# Altium project Industrial-IO.PrjPcb
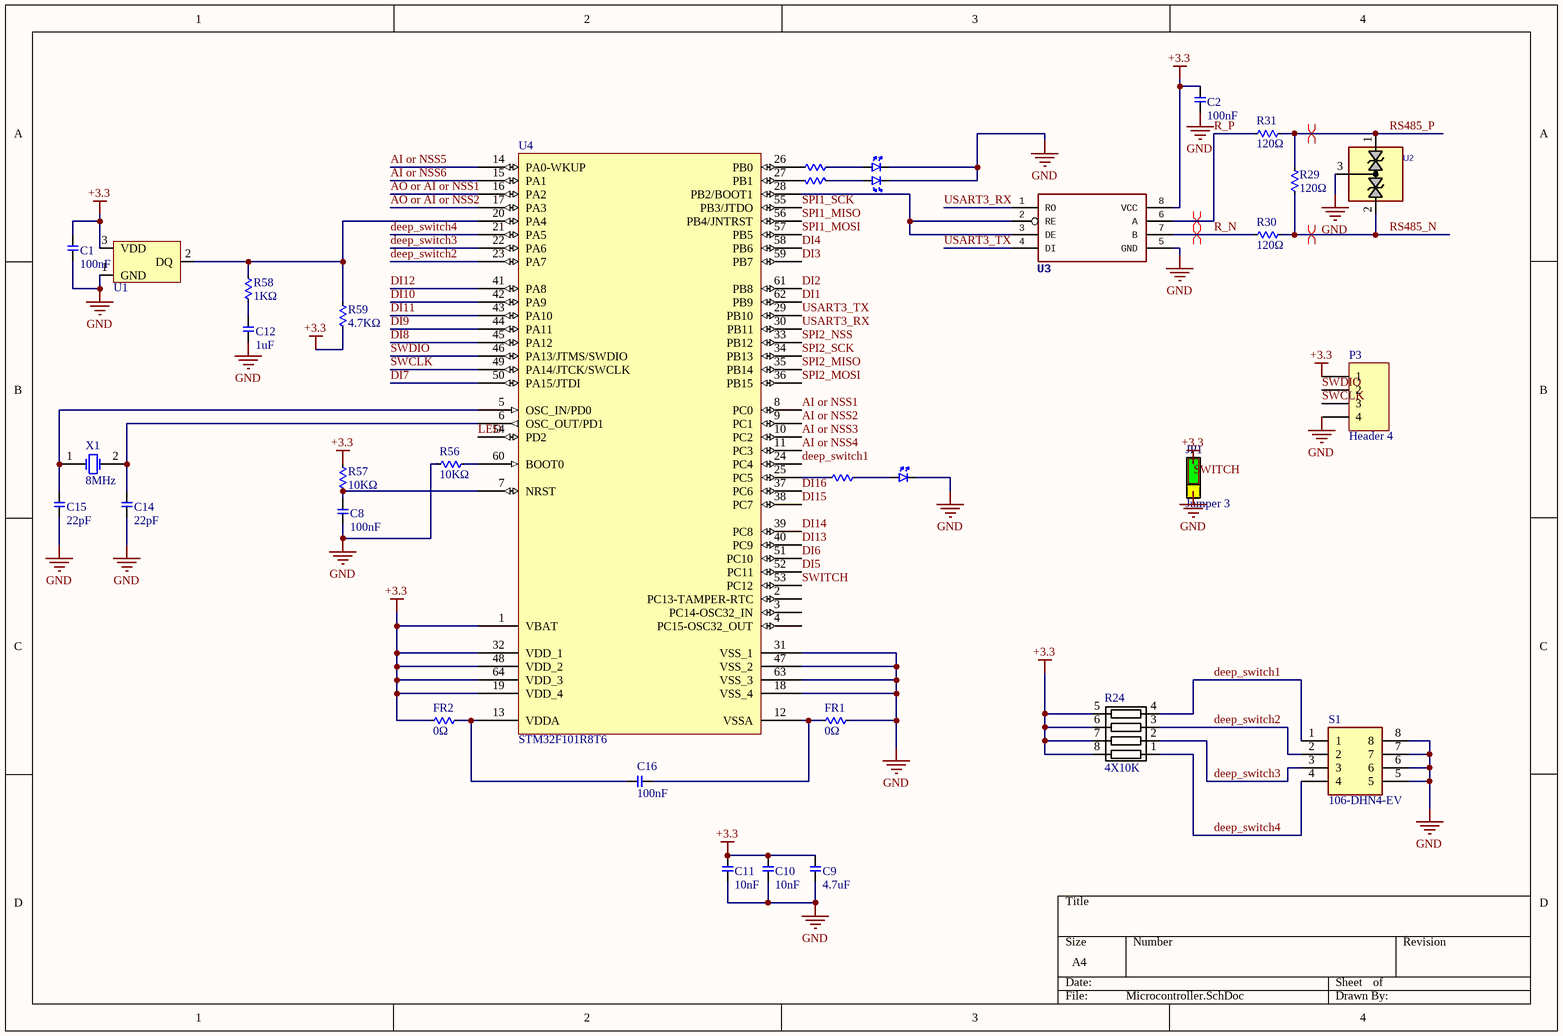
[diagram p0: Microcontroller.SchDoc]
5 sheets, 229 parts. Net scope: global (net labels, ports and power ports of the same name join across sheets).
Board file: Industrial-IO.PcbDoc
Sheets:
  Microcontroller.SchDoc
  Digital Input.SchDoc
  Digital Output.SchDoc
  Connector.SchDoc
  Indicator.SchDoc

## Sheet Microcontroller.SchDoc
size A4

### Parts
(Parts that share a designator on the sheet are numbered #1, #2 ... from top to bottom, then left to right.)
C1  100nF  [CAP 0603 100n]
C2  100nF  [CAP_0603]
C8  100nF  [CAP_0603]
C9  4.7uF  [CAP 0603 4.7u]
C10  10nF  [CAP 0603 10n]
C11  10nF  [CAP 0603 10n]
C12  1uF  [CAP 0603 1u]
C14  22pF  [CAP 0603 22p]
C15  22pF  [CAP 0603 22p]
C16  100nF  [CAP 0603 100n]
D1  LED  [LED 0603 RED]  (value not drawn)
D18  LED  [LED 0603 GREEN]  (value not drawn)
D19  LED  [LED 0603 GREEN]  (value not drawn)
FR1  0Ω  [RES 0603 0]
FR2  0Ω  [RES 0603 0]
JP1  Jumper 3  [Jumper 3 Blue]
P3#1  Header 4  [CON_MALE_4_2.54MM]
R17  100Ω  [RES 0603 100]  (value not drawn)
R18  100Ω  [RES 0603 100]  (value not drawn)
R19  100Ω  [RES 0603 100]  (value not drawn)
R24  4X10K  [RES ARRAY 4X0603 1.2K]
R29  120Ω  [RES 0603 120]
R30  120Ω  [RES 0603 120]
R31  120Ω  [RES 0603 120]
R56  10KΩ  [RES 0603 10K]
R57  10KΩ  [RES 0603 10K]
R58  1KΩ  [RES 0603]
R59  4.7KΩ  [RES 0603 4.7K]
S1  106-DHN4-EV  [dip_switch4]
U1  DS18B20  [SEMI_TO92W]  (value not drawn)
U2  CDSOT23-SM712  [SOT23_3]  (value not drawn)
U3  ADM485  [SEMI_SO8]  (value not drawn)
U4  STM32F101R8T6  [LQFP64_N]
X1  value 8MHz  [XTAL_HC49S]  (hidden comment: Xtal)

### Nets
+3.3: C1.1 C2.1 C9.1 C10.1 C11.1 FR2.1 JP1.1 P3#1.1 R24.5 R24.6 R24.7 R24.8 R57.1 R59.2 U1.3(VDD) U3.8(VCC) U4.1(VBAT) U4.19(VDD_4) U4.32(VDD_1) U4.48(VDD_2) U4.64(VDD_3)
GND: C1.2 C2.2 C8.2 C9.2 C10.2 C11.2 C12.2 C14.2 C15.2 D1.2 D18.2 D19.2 FR1.2 JP1.3 P3#1.4 R56.1 S1.5 S1.6 S1.7 S1.8 U1.1(GND) U2.3(NC) U3.5(GND) U4.18(VSS_4) U4.31(VSS_1) U4.47(VSS_2) U4.63(VSS_3)
AI or NSS1: U4.8(PC0)
AI or NSS2: U4.9(PC1)
AI or NSS3: U4.10(PC2)
AI or NSS4: U4.11(PC3)
AI or NSS5: U4.14(PA0-WKUP)
AI or NSS6: U4.15(PA1)
AO or AI or NSS1: U4.16(PA2)
AO or AI or NSS2: U4.17(PA3)
deep_switch1: R24.4 S1.1 U4.24(PC4)
deep_switch2: R24.3 S1.2 U4.23(PA7)
deep_switch3: R24.2 S1.3 U4.22(PA6)
deep_switch4: R24.1 S1.4 U4.21(PA5)
DI1: U4.62(PB9)
DI2: U4.61(PB8)
DI3: U4.59(PB7)
DI4: U4.58(PB6)
DI5: U4.52(PC11)
DI6: U4.51(PC10)
DI7: U4.50(PA15/JTDI)
DI8: U4.45(PA12)
DI9: U4.44(PA11)
DI10: U4.42(PA9)
DI11: U4.43(PA10)
DI12: U4.41(PA8)
DI13: U4.40(PC9)
DI14: U4.39(PC8)
DI15: U4.38(PC7)
DI16: U4.37(PC6)
LED: U4.54(PD2)
R_N: R30.1 U3.7(B)
R_P: R31.1 U3.6(A)
RS485_N: R29.2 R30.2 U2.2(GND)
RS485_P: R29.1 R31.2 U2.1(NC)
SPI1_MISO: U4.56(PB4/JNTRST)
SPI1_MOSI: U4.57(PB5)
SPI1_SCK: U4.55(PB3/JTDO)
SPI2_MISO: U4.35(PB14)
SPI2_MOSI: U4.36(PB15)
SPI2_NSS: U4.33(PB12)
SPI2_SCK: U4.34(PB13)
SWCLK: P3#1.3 U4.49(PA14/JTCK/SWCLK)
SWDIO: P3#1.2 U4.46(PA13/JTMS/SWDIO)
SWITCH: JP1.2 U4.53(PC12)
USART3_RX: U3.1(RO) U4.30(PB11)
USART3_TX: U3.4(DI) U4.29(PB10)
NetC8_1: C8.1 R57.2 U4.7(NRST)
NetC12_1: C12.1 R58.2
NetC14_1: C14.1 U4.6(OSC_OUT/PD1) X1.2(OSC2)
NetC15_1: C15.1 U4.5(OSC_IN/PD0) X1.1(OSC1)
NetC16_1: C16.1 FR2.2 U4.13(VDDA)
NetC16_2: C16.2 FR1.1 U4.12(VSSA)
NetD1_1: D1.1 R17.1
NetD18_1: D18.1 R18.1
NetD19_1: D19.1 R19.1
NetR17_2: R17.2 U4.27(PB1)
NetR18_2: R18.2 U4.26(PB0)
NetR19_2: R19.2 U4.25(PC5)
NetR56_2: R56.2 U4.60(BOOT0)
NetR58_1: R58.1 R59.1 U1.2(DQ) U4.20(PA4)
NetU3_2: U3.2(RE) U3.3(DE) U4.28(PB2/BOOT1)

Not connected (* = marked no-connect by the designer): U4 2(PC13-TAMPER-RTC) 3(PC14-OSC32_IN) 4(PC15-OSC32_OUT)

### Layout directives
differential pair: R_N, R_P, RS485_N, RS485_P

### Library data of the parts
C1 C2 C8 C16 = CAP 100nF
C9 = CAP 4.7uF
C10 C11 = CAP 10nF
C12 = CAP 1UF
C14 C15 = CAP 22pF
FR1 FR2 = RES 0
P3#1 = Header 4: Header, 4-Pin; LatestRevisionDate: 17-Jul-2002; LatestRevisionNote: Re-released for DXP Platform.; Publisher: Altium Limited
R17-R19 = RES 100
R24 = ARRAY4-10K-BOURNS: GENERIC RESISTOR ARRAY 4X INDEPENDENT; Reel: RA4
R29-R31 = RES 120
R56 R57 = RES 10K
R58 = RES
R59 = RES 4.7K
S1 = 106-DHN4-EV: Switch; Manufacturer_Name: Mountain Switch; Datasheet Link: https://componentsearchengine.com/Datasheets/1/106-DHN4-EV.pdf; Height: 1.55mm; Manufacturer_Part_Number: 106-DHN4-EV; Arrow Part Number: 106-DHN4-EV; Mouser Part Number: 106-DHN4-EV; Mouser Price/Stock: https://www.mouser.com/Search/Refine.aspx?Keyword=106-DHN4-EV
U2 = TVS_X2_CDSOT23-SM712: TVS, ESD PROTECT, 2CH, 400W/17A PP, 7.5VBR, ±8KV ESDmin; MANF: Bourns; PARAM: 400W/17A peak-pulse; MANF_P#: CDSOT23-SM712; PARAM2: 7.5VBR, ±8KV ESD min; PRICE: 1.6$; VALUE: CDSOT23-SM712
U4 = STM32F101R8T6: STM32 ARM-based 32-bit MCU with 64 Kbytes Flash, 64-pin LQFP, Industrial Temperature; Published: 30-May-2008; DatasheetVersion: rev6, Mar-2008; PackageVersion: Mar-2008; PackageReference: LQFP64; Publisher: Altium Limited; PackageDescription: 64-Pin Low-Profile Quad Flat Pack, 10 x 10 mm Body, 0.5 mm Pitch (LQFP64); ComponentLink1Description: Manufacturer Link; ComponentLink1URL: www.st.com/stm32; ComponentLink2Description: Datasheet; ComponentLink2URL: http://www.st.com/stonline/products/literature/ds/13586.pdf

## Sheet Digital Input.SchDoc
size A4
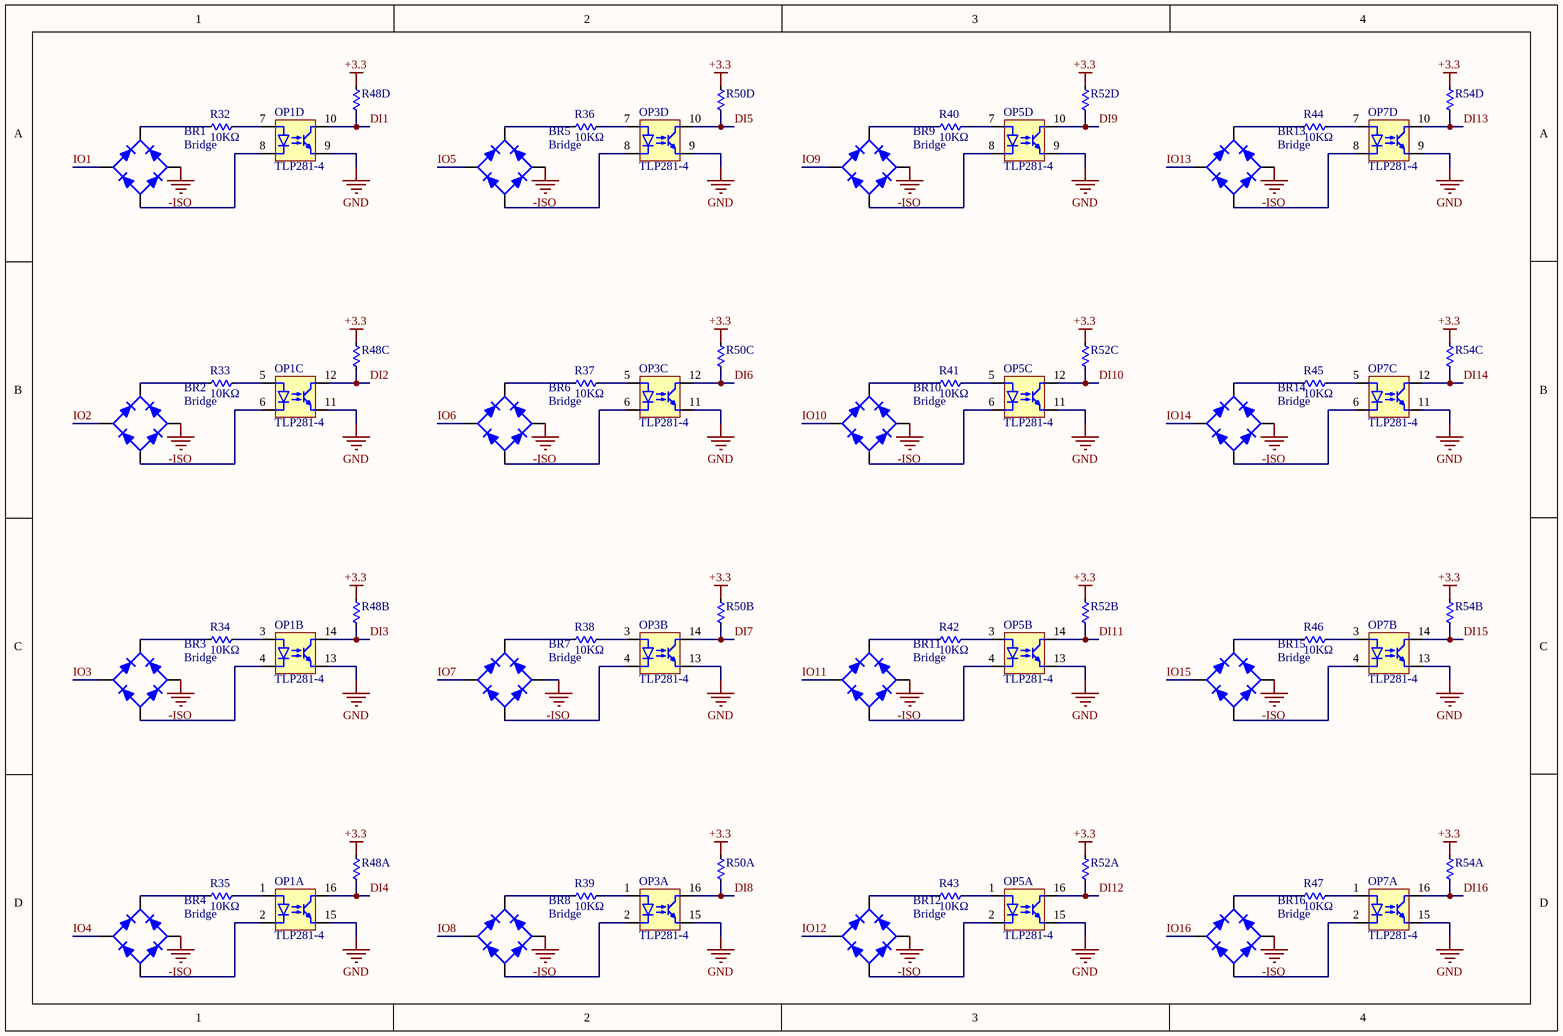
[diagram p1: Digital Input.SchDoc]

### Parts
BR1  Bridge  [SOP254P690X270-4L]
BR2  Bridge  [SOP254P690X270-4L]
BR3  Bridge  [SOP254P690X270-4L]
BR4  Bridge  [SOP254P690X270-4L]
BR5  Bridge  [SOP254P690X270-4L]
BR6  Bridge  [SOP254P690X270-4L]
BR7  Bridge  [SOP254P690X270-4L]
BR8  Bridge  [SOP254P690X270-4L]
BR9  Bridge  [SOP254P690X270-4L]
BR10  Bridge  [SOP254P690X270-4L]
BR11  Bridge  [SOP254P690X270-4L]
BR12  Bridge  [SOP254P690X270-4L]
BR13  Bridge  [SOP254P690X270-4L]
BR14  Bridge  [SOP254P690X270-4L]
BR15  Bridge  [SOP254P690X270-4L]
BR16  Bridge  [SOP254P690X270-4L]
OP1  TLP281-4  [SO16 TOSHIBA OPTOCOUPLER]  (parts A,B,C,D of 4)
OP3  TLP281-4  [SO16 TOSHIBA OPTOCOUPLER]  (parts A,B,C,D of 4)
OP5  TLP281-4  [SO16 TOSHIBA OPTOCOUPLER]  (parts A,B,C,D of 4)
OP7  TLP281-4  [SO16 TOSHIBA OPTOCOUPLER]  (parts A,B,C,D of 4)
R32  10KΩ  [RES 0603 10K]
R33  10KΩ  [RES 0603 10K]
R34  10KΩ  [RES 0603 10K]
R35  10KΩ  [RES 0603 10K]
R36  10KΩ  [RES 0603 10K]
R37  10KΩ  [RES 0603 10K]
R38  10KΩ  [RES 0603 10K]
R39  10KΩ  [RES 0603 10K]
R40  10KΩ  [RES 0603 10K]
R41  10KΩ  [RES 0603 10K]
R42  10KΩ  [RES 0603 10K]
R43  10KΩ  [RES 0603 10K]
R44  10KΩ  [RES 0603 10K]
R45  10KΩ  [RES 0603 10K]
R46  10KΩ  [RES 0603 10K]
R47  10KΩ  [RES 0603 10K]
R48  10KΩ  [RES ARRAY 4X0603 10K]  (value not drawn)  (parts A,B,C,D of 4)
R50  10KΩ  [RES ARRAY 4X0603 10K]  (value not drawn)  (parts A,B,C,D of 4)
R52  10KΩ  [RES ARRAY 4X0603 10K]  (value not drawn)  (parts A,B,C,D of 4)
R54  10KΩ  [RES ARRAY 4X0603 10K]  (value not drawn)  (parts A,B,C,D of 4)

### Nets
+3.3: R48.5 R48.6 R48.7 R48.8 R50.5 R50.6 R50.7 R50.8 R52.5 R52.6 R52.7 R52.8 R54.5 R54.6 R54.7 R54.8
-ISO: BR1.4 BR2.4 BR3.4 BR4.4 BR5.4 BR6.4 BR7.4 BR8.4 BR9.4 BR10.4 BR11.4 BR12.4 BR13.4 BR14.4 BR15.4 BR16.4
GND: OP1.9 OP1.11 OP1.13 OP1.15 OP3.9 OP3.11 OP3.13 OP3.15 OP5.9 OP5.11 OP5.13 OP5.15 OP7.9 OP7.11 OP7.13 OP7.15
DI1: OP1.10 R48.4
DI2: OP1.12 R48.3
DI3: OP1.14 R48.2
DI4: OP1.16 R48.1
DI5: OP3.10 R50.4
DI6: OP3.12 R50.3
DI7: OP3.14 R50.2
DI8: OP3.16 R50.1
DI9: OP5.10 R52.4
DI10: OP5.12 R52.3
DI11: OP5.14 R52.2
DI12: OP5.16 R52.1
DI13: OP7.10 R54.4
DI14: OP7.12 R54.3
DI15: OP7.14 R54.2
DI16: OP7.16 R54.1
IO1: BR1.3
IO2: BR2.3
IO3: BR3.3
IO4: BR4.3
IO5: BR5.3
IO6: BR6.3
IO7: BR7.3
IO8: BR8.3
IO9: BR9.3
IO10: BR10.3
IO11: BR11.3
IO12: BR12.3
IO13: BR13.3
IO14: BR14.3
IO15: BR15.3
IO16: BR16.3
NetBR1_1: BR1.1(+) R32.1
NetBR1_2: BR1.2(-) OP1.8
NetBR2_1: BR2.1(+) R33.1
NetBR2_2: BR2.2(-) OP1.6
NetBR3_1: BR3.1(+) R34.1
NetBR3_2: BR3.2(-) OP1.4
NetBR4_1: BR4.1(+) R35.1
NetBR4_2: BR4.2(-) OP1.2
NetBR5_1: BR5.1(+) R36.1
NetBR5_2: BR5.2(-) OP3.8
NetBR6_1: BR6.1(+) R37.1
NetBR6_2: BR6.2(-) OP3.6
NetBR7_1: BR7.1(+) R38.1
NetBR7_2: BR7.2(-) OP3.4
NetBR8_1: BR8.1(+) R39.1
NetBR8_2: BR8.2(-) OP3.2
NetBR9_1: BR9.1(+) R40.1
NetBR9_2: BR9.2(-) OP5.8
NetBR10_1: BR10.1(+) R41.1
NetBR10_2: BR10.2(-) OP5.6
NetBR11_1: BR11.1(+) R42.1
NetBR11_2: BR11.2(-) OP5.4
NetBR12_1: BR12.1(+) R43.1
NetBR12_2: BR12.2(-) OP5.2
NetBR13_1: BR13.1(+) R44.1
NetBR13_2: BR13.2(-) OP7.8
NetBR14_1: BR14.1(+) R45.1
NetBR14_2: BR14.2(-) OP7.6
NetBR15_1: BR15.1(+) R46.1
NetBR15_2: BR15.2(-) OP7.4
NetBR16_1: BR16.1(+) R47.1
NetBR16_2: BR16.2(-) OP7.2
NetOP1_1: OP1.1 R35.2
NetOP1_3: OP1.3 R34.2
NetOP1_5: OP1.5 R33.2
NetOP1_7: OP1.7 R32.2
NetOP3_1: OP3.1 R39.2
NetOP3_3: OP3.3 R38.2
NetOP3_5: OP3.5 R37.2
NetOP3_7: OP3.7 R36.2
NetOP5_1: OP5.1 R43.2
NetOP5_3: OP5.3 R42.2
NetOP5_5: OP5.5 R41.2
NetOP5_7: OP5.7 R40.2
NetOP7_1: OP7.1 R47.2
NetOP7_3: OP7.3 R46.2
NetOP7_5: OP7.5 R45.2
NetOP7_7: OP7.7 R44.2

### Library data of the parts
R32-R47 = RES 10K
R48 R50 R52 R54 = RES ARRAY 10K

## Sheet Digital Output.SchDoc
size A4
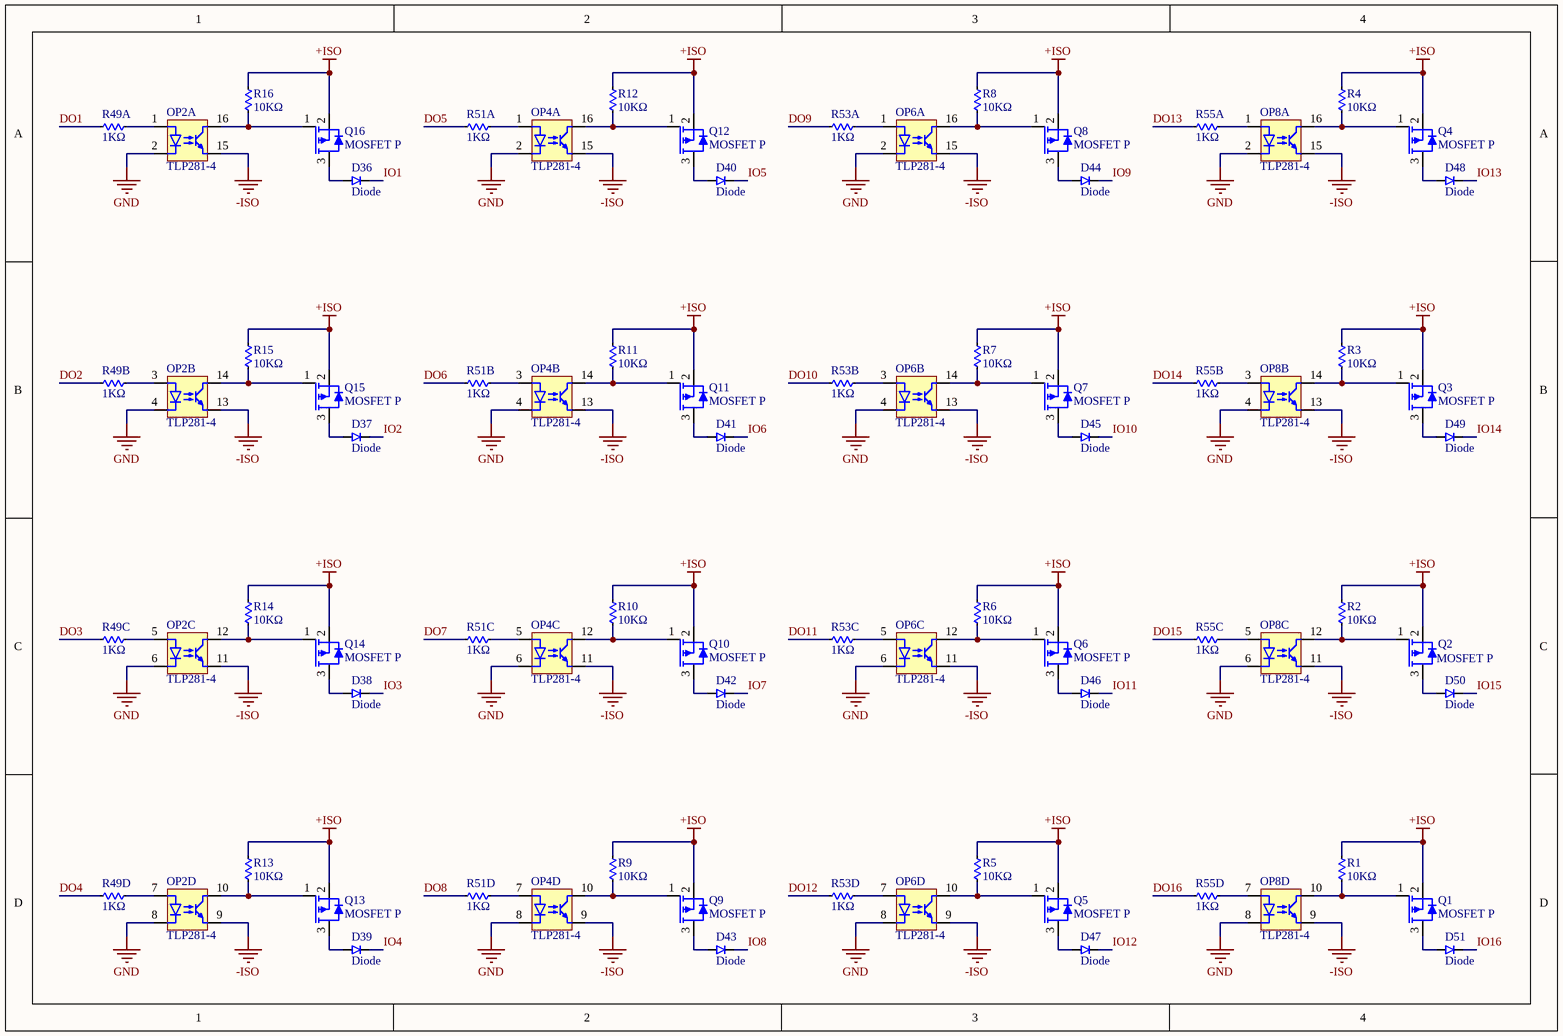
[diagram p2: Digital Output.SchDoc]

### Parts
D36  Diode  [DIOMELF3515L]
D37  Diode  [DIOMELF3515L]
D38  Diode  [DIOMELF3515L]
D39  Diode  [DIOMELF3515L]
D40  Diode  [DIOMELF3515L]
D41  Diode  [DIOMELF3515L]
D42  Diode  [DIOMELF3515L]
D43  Diode  [DIOMELF3515L]
D44  Diode  [DIOMELF3515L]
D45  Diode  [DIOMELF3515L]
D46  Diode  [DIOMELF3515L]
D47  Diode  [DIOMELF3515L]
D48  Diode  [DIOMELF3515L]
D49  Diode  [DIOMELF3515L]
D50  Diode  [DIOMELF3515L]
D51  Diode  [DIOMELF3515L]
OP2  TLP281-4  [SO16 TOSHIBA OPTOCOUPLER]  (parts A,B,C,D of 4)
OP4  TLP281-4  [SO16 TOSHIBA OPTOCOUPLER]  (parts A,B,C,D of 4)
OP6  TLP281-4  [SO16 TOSHIBA OPTOCOUPLER]  (parts A,B,C,D of 4)
OP8  TLP281-4  [SO16 TOSHIBA OPTOCOUPLER]  (parts A,B,C,D of 4)
Q1  MOSFET P  [SOT23]
Q2  MOSFET P  [SOT23]
Q3  MOSFET P  [SOT23]
Q4  MOSFET P  [SOT23]
Q5  MOSFET P  [SOT23]
Q6  MOSFET P  [SOT23]
Q7  MOSFET P  [SOT23]
Q8  MOSFET P  [SOT23]
Q9  MOSFET P  [SOT23]
Q10  MOSFET P  [SOT23]
Q11  MOSFET P  [SOT23]
Q12  MOSFET P  [SOT23]
Q13  MOSFET P  [SOT23]
Q14  MOSFET P  [SOT23]
Q15  MOSFET P  [SOT23]
Q16  MOSFET P  [SOT23]
R1  10KΩ  [RES 0603 10K]
R2  10KΩ  [RES 0603 10K]
R3  10KΩ  [RES 0603 10K]
R4  10KΩ  [RES 0603 10K]
R5  10KΩ  [RES 0603 10K]
R6  10KΩ  [RES 0603 10K]
R7  10KΩ  [RES 0603 10K]
R8  10KΩ  [RES 0603 10K]
R9  10KΩ  [RES 0603 10K]
R10  10KΩ  [RES 0603 10K]
R11  10KΩ  [RES 0603 10K]
R12  10KΩ  [RES 0603 10K]
R13  10KΩ  [RES 0603 10K]
R14  10KΩ  [RES 0603 10K]
R15  10KΩ  [RES 0603 10K]
R16  10KΩ  [RES 0603 10K]
R49  1KΩ  [RES ARRAY 4X0603 1K]  (parts A,B,C,D of 4)
R51  1KΩ  [RES ARRAY 4X0603 1K]  (parts A,B,C,D of 4)
R53  1KΩ  [RES ARRAY 4X0603 1K]  (parts A,B,C,D of 4)
R55  1KΩ  [RES ARRAY 4X0603 1K]  (parts A,B,C,D of 4)

### Nets
+ISO: Q1.2(S) Q2.2(S) Q3.2(S) Q4.2(S) Q5.2(S) Q6.2(S) Q7.2(S) Q8.2(S) Q9.2(S) Q10.2(S) Q11.2(S) Q12.2(S) Q13.2(S) Q14.2(S) Q15.2(S) Q16.2(S) R1.2 R2.2 R3.2 R4.2 R5.2 R6.2 R7.2 R8.2 R9.2 R10.2 R11.2 R12.2 R13.2 R14.2 R15.2 R16.2
-ISO: OP2.9 OP2.11 OP2.13 OP2.15 OP4.9 OP4.11 OP4.13 OP4.15 OP6.9 OP6.11 OP6.13 OP6.15 OP8.9 OP8.11 OP8.13 OP8.15
GND: OP2.2 OP2.4 OP2.6 OP2.8 OP4.2 OP4.4 OP4.6 OP4.8 OP6.2 OP6.4 OP6.6 OP6.8 OP8.2 OP8.4 OP8.6 OP8.8
DO1: R49.1
DO2: R49.2
DO3: R49.3
DO4: R49.4
DO5: R51.1
DO6: R51.2
DO7: R51.3
DO8: R51.4
DO9: R53.1
DO10: R53.2
DO11: R53.3
DO12: R53.4
DO13: R55.1
DO14: R55.2
DO15: R55.3
DO16: R55.4
IO1: D36.1
IO2: D37.1
IO3: D38.1
IO4: D39.1
IO5: D40.1
IO6: D41.1
IO7: D42.1
IO8: D43.1
IO9: D44.1
IO10: D45.1
IO11: D46.1
IO12: D47.1
IO13: D48.1
IO14: D49.1
IO15: D50.1
IO16: D51.1
NetD36_2: D36.2 Q16.3(D)
NetD37_2: D37.2 Q15.3(D)
NetD38_2: D38.2 Q14.3(D)
NetD39_2: D39.2 Q13.3(D)
NetD40_2: D40.2 Q12.3(D)
NetD41_2: D41.2 Q11.3(D)
NetD42_2: D42.2 Q10.3(D)
NetD43_2: D43.2 Q9.3(D)
NetD44_2: D44.2 Q8.3(D)
NetD45_2: D45.2 Q7.3(D)
NetD46_2: D46.2 Q6.3(D)
NetD47_2: D47.2 Q5.3(D)
NetD48_2: D48.2 Q4.3(D)
NetD49_2: D49.2 Q3.3(D)
NetD50_2: D50.2 Q2.3(D)
NetD51_2: D51.2 Q1.3(D)
NetOP2_1: OP2.1 R49.8
NetOP2_3: OP2.3 R49.7
NetOP2_5: OP2.5 R49.6
NetOP2_7: OP2.7 R49.5
NetOP2_10: OP2.10 Q13.1(G) R13.1
NetOP2_12: OP2.12 Q14.1(G) R14.1
NetOP2_14: OP2.14 Q15.1(G) R15.1
NetOP2_16: OP2.16 Q16.1(G) R16.1
NetOP4_1: OP4.1 R51.8
NetOP4_3: OP4.3 R51.7
NetOP4_5: OP4.5 R51.6
NetOP4_7: OP4.7 R51.5
NetOP4_10: OP4.10 Q9.1(G) R9.1
NetOP4_12: OP4.12 Q10.1(G) R10.1
NetOP4_14: OP4.14 Q11.1(G) R11.1
NetOP4_16: OP4.16 Q12.1(G) R12.1
NetOP6_1: OP6.1 R53.8
NetOP6_3: OP6.3 R53.7
NetOP6_5: OP6.5 R53.6
NetOP6_7: OP6.7 R53.5
NetOP6_10: OP6.10 Q5.1(G) R5.1
NetOP6_12: OP6.12 Q6.1(G) R6.1
NetOP6_14: OP6.14 Q7.1(G) R7.1
NetOP6_16: OP6.16 Q8.1(G) R8.1
NetOP8_1: OP8.1 R55.8
NetOP8_3: OP8.3 R55.7
NetOP8_5: OP8.5 R55.6
NetOP8_7: OP8.7 R55.5
NetOP8_10: OP8.10 Q1.1(G) R1.1
NetOP8_12: OP8.12 Q2.1(G) R2.1
NetOP8_14: OP8.14 Q3.1(G) R3.1
NetOP8_16: OP8.16 Q4.1(G) R4.1

### Library data of the parts
R1-R16 = RES 10K
R49 R51 R53 R55 = RES ARRAY 1K

## Sheet Connector.SchDoc
size A4
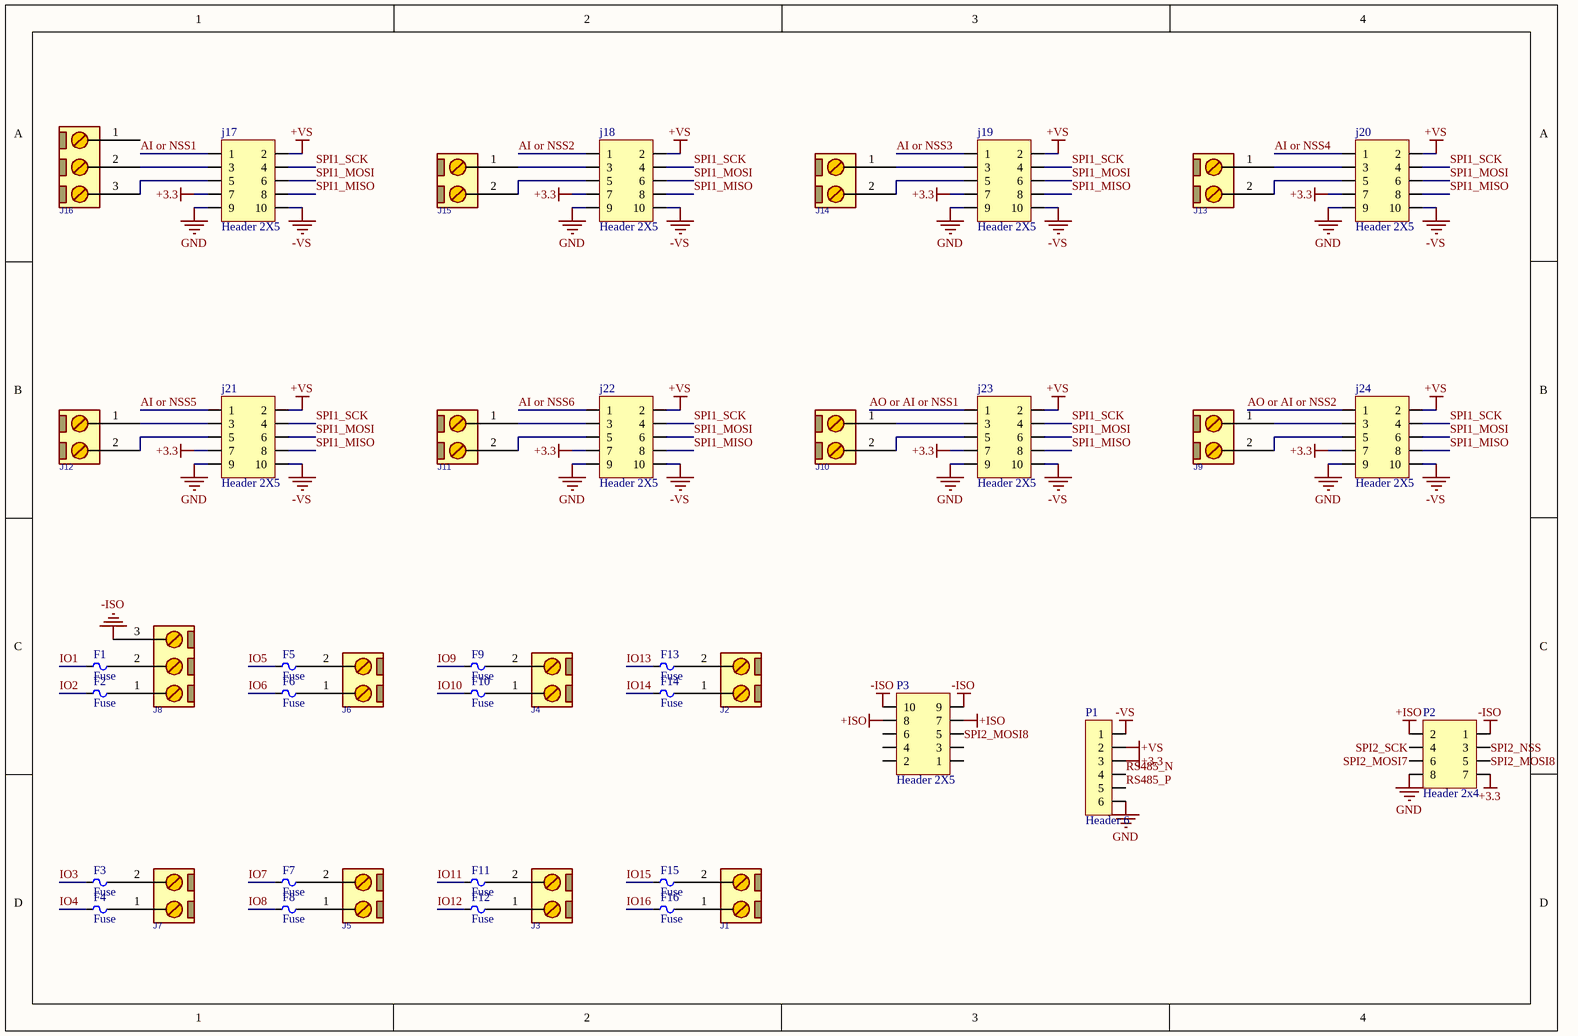
[diagram p3: Connector.SchDoc]

### Parts
(Parts that share a designator on the sheet are numbered #1, #2 ... from top to bottom, then left to right.)
F1  Fuse  [Fuse 0805]
F2  Fuse  [Fuse 0805]
F3  Fuse  [Fuse 0805]
F4  Fuse  [Fuse 0805]
F5  Fuse  [Fuse 0805]
F6  Fuse  [Fuse 0805]
F7  Fuse  [Fuse 0805]
F8  Fuse  [Fuse 0805]
F9  Fuse  [Fuse 0805]
F10  Fuse  [Fuse 0805]
F11  Fuse  [Fuse 0805]
F12  Fuse  [Fuse 0805]
F13  Fuse  [Fuse 0805]
F14  Fuse  [Fuse 0805]
F15  Fuse  [Fuse 0805]
F16  Fuse  [Fuse 0805]
J1  CONN_TB2  [TBG_2]  (value not drawn)
J2  CONN_TB2  [TBG_2]  (value not drawn)
J3  CONN_TB2  [TBG_2]  (value not drawn)
J4  CONN_TB2  [TBG_2]  (value not drawn)
J5  CONN_TB2  [TBG_2]  (value not drawn)
J6  CONN_TB2  [TBG_2]  (value not drawn)
J7  CONN_TB2  [TBG_2]  (value not drawn)
J8  CONN_TB3  [TBG_3]  (value not drawn)
J9  CONN_TB2  [TBG_2]  (value not drawn)
J10  CONN_TB2  [TBG_2]  (value not drawn)
J11  CONN_TB2  [TBG_2]  (value not drawn)
J12  CONN_TB2  [TBG_2]  (value not drawn)
J13  CONN_TB2  [TBG_2]  (value not drawn)
J14  CONN_TB2  [TBG_2]  (value not drawn)
J15  CONN_TB2  [TBG_2]  (value not drawn)
J16  CONN_TB3  [TBG_3]  (value not drawn)
j17  Header 2X5  [HDR2_F_2X5]
j18  Header 2X5  [HDR2_F_2X5]
j19  Header 2X5  [HDR2_F_2X5]
j20  Header 2X5  [HDR2_F_2X5]
j21  Header 2X5  [HDR2_F_2X5]
j22  Header 2X5  [HDR2_F_2X5]
j23  Header 2X5  [HDR2_F_2X5]
j24  Header 2X5  [HDR2_F_2X5]
P1  Header 6  [Header 6]
P2  Header 2x4  [HDR 2X4 M ST 2.54]
P3#2  Header 2X5  [IDC 2X5 M ST 2.54]

### Nets
+3.3: j17.7 j18.7 j19.7 j20.7 j21.7 j22.7 j23.7 j24.7 P1.3 P2.7
+ISO: P2.2 P3#2.7 P3#2.8
+VS: j17.2 j18.2 j19.2 j20.2 j21.2 j22.2 j23.2 j24.2 P1.2
-ISO: J8.3 P2.1 P3#2.9 P3#2.10
-VS: j17.10 j18.10 j19.10 j20.10 j21.10 j22.10 j23.10 j24.10 P1.1
GND: j17.9 j18.9 j19.9 j20.9 j21.9 j22.9 j23.9 j24.9 P1.6 P2.8
AI or NSS1: j17.1
AI or NSS2: j18.1
AI or NSS3: j19.1
AI or NSS4: j20.1
AI or NSS5: j21.1
AI or NSS6: j22.1
AO or AI or NSS1: j23.1
AO or AI or NSS2: j24.1
IO1: F1.1
IO2: F2.1
IO3: F3.1
IO4: F4.1
IO5: F5.1
IO6: F6.1
IO7: F7.1
IO8: F8.1
IO9: F9.1
IO10: F10.1
IO11: F11.1
IO12: F12.1
IO13: F13.1
IO14: F14.1
IO15: F15.1
IO16: F16.1
RS485_N: P1.4
RS485_P: P1.5
SPI1_MISO: j17.8 j18.8 j19.8 j20.8 j21.8 j22.8 j23.8 j24.8
SPI1_MOSI: j17.6 j18.6 j19.6 j20.6 j21.6 j22.6 j23.6 j24.6
SPI1_SCK: j17.4 j18.4 j19.4 j20.4 j21.4 j22.4 j23.4 j24.4
SPI2_MOSI7: P2.6
SPI2_MOSI8: P2.5 P3#2.5
SPI2_NSS: P2.3
SPI2_SCK: P2.4
NetF1_2: F1.2 J8.2
NetF2_2: F2.2 J8.1
NetF3_2: F3.2 J7.2
NetF4_2: F4.2 J7.1
NetF5_2: F5.2 J6.2
NetF6_2: F6.2 J6.1
NetF7_2: F7.2 J5.2
NetF8_2: F8.2 J5.1
NetF9_2: F9.2 J4.2
NetF10_2: F10.2 J4.1
NetF11_2: F11.2 J3.2
NetF12_2: F12.2 J3.1
NetF13_2: F13.2 J2.2
NetF14_2: F14.2 J2.1
NetF15_2: F15.2 J1.2
NetF16_2: F16.2 J1.1
NetJ9_1: J9.1 j24.3
NetJ9_2: J9.2 j24.5
NetJ10_1: J10.1 j23.3
NetJ10_2: J10.2 j23.5
NetJ11_1: J11.1 j22.3
NetJ11_2: J11.2 j22.5
NetJ12_1: J12.1 j21.3
NetJ12_2: J12.2 j21.5
NetJ13_1: J13.1 j20.3
NetJ13_2: J13.2 j20.5
NetJ14_1: J14.1 j19.3
NetJ14_2: J14.2 j19.5
NetJ15_1: J15.1 j18.3
NetJ15_2: J15.2 j18.5
NetJ16_2: J16.2 j17.3
NetJ16_3: J16.3 j17.5

Not connected (* = marked no-connect by the designer): J16 1; P3#2 1 2 3 4 6

### Library data of the parts
J1-J7 J9-J15 = CONN_TB2: CONN, TERMINAL BLOCK, 5.08mm pitch; VALUE: CONN_TB2
J8 J16 = CONN_TB3: CONN, TERMINAL BLOCK, 5.08mm pitch; VALUE: CONN_TB3

## Sheet Indicator.SchDoc
size A4
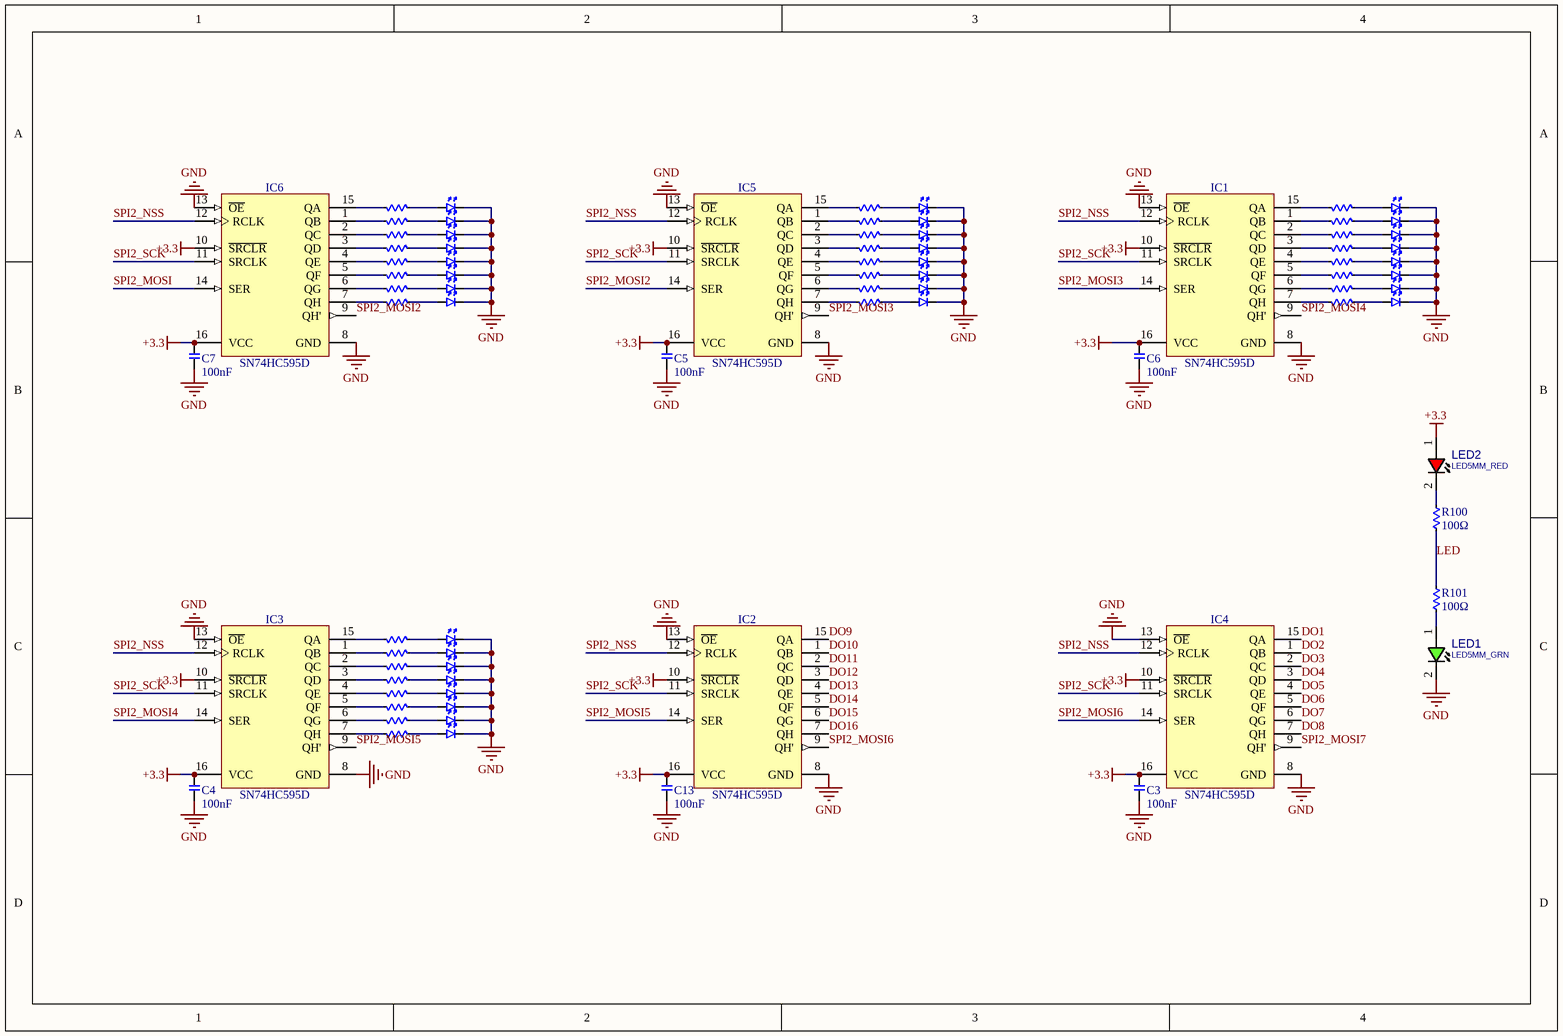
[diagram p4: Indicator.SchDoc]

### Parts
C3  100nF  [CAP_0603]
C4  100nF  [CAP_0603]
C5  100nF  [CAP_0603]
C6  100nF  [CAP_0603]
C7  100nF  [CAP_0603]
C13  100nF  [CAP_0603]
D2  LED  [LED 0603 GREEN]  (value not drawn)
D3  LED  [LED 0603 GREEN]  (value not drawn)
D4  LED  [LED 0603 GREEN]  (value not drawn)
D5  LED  [LED 0603 GREEN]  (value not drawn)
D6  LED  [LED 0603 GREEN]  (value not drawn)
D7  LED  [LED 0603 GREEN]  (value not drawn)
D8  LED  [LED 0603 GREEN]  (value not drawn)
D9  LED  [LED 0603 GREEN]  (value not drawn)
D10  LED  [LED 0603 GREEN]  (value not drawn)
D11  LED  [LED 0603 GREEN]  (value not drawn)
D12  LED  [LED 0603 GREEN]  (value not drawn)
D13  LED  [LED 0603 GREEN]  (value not drawn)
D14  LED  [LED 0603 GREEN]  (value not drawn)
D15  LED  [LED 0603 GREEN]  (value not drawn)
D16  LED  [LED 0603 GREEN]  (value not drawn)
D17  LED  [LED 0603 GREEN]  (value not drawn)
D20  LED  [LED 0603 GREEN]  (value not drawn)
D21  LED  [LED 0603 GREEN]  (value not drawn)
D22  LED  [LED 0603 GREEN]  (value not drawn)
D23  LED  [LED 0603 GREEN]  (value not drawn)
D24  LED  [LED 0603 GREEN]  (value not drawn)
D25  LED  [LED 0603 GREEN]  (value not drawn)
D26  LED  [LED 0603 GREEN]  (value not drawn)
D27  LED  [LED 0603 GREEN]  (value not drawn)
D28  LED  [LED 0603 GREEN]  (value not drawn)
D29  LED  [LED 0603 GREEN]  (value not drawn)
D30  LED  [LED 0603 GREEN]  (value not drawn)
D31  LED  [LED 0603 GREEN]  (value not drawn)
D32  LED  [LED 0603 GREEN]  (value not drawn)
D33  LED  [LED 0603 GREEN]  (value not drawn)
D34  LED  [LED 0603 GREEN]  (value not drawn)
D35  LED  [LED 0603 GREEN]  (value not drawn)
IC1  SN74HC595D  [SOIC127P600X175-16N]
IC2  SN74HC595D  [SOIC127P600X175-16N]
IC3  SN74HC595D  [SOIC127P600X175-16N]
IC4  SN74HC595D  [SOIC127P600X175-16N]
IC5  SN74HC595D  [SOIC127P600X175-16N]
IC6  SN74HC595D  [SOIC127P600X175-16N]
LED1  LED5MM_GRN  [LED5MM_GRN]
LED2  LED5MM_RED  [LED5MM_RED]
R20  100Ω  [RES ARRAY 4X0603 100]  (value not drawn)  (parts A,B,C,D of 4)
R21  100Ω  [RES ARRAY 4X0603 100]  (value not drawn)  (parts A,B,C,D of 4)
R22  100Ω  [RES ARRAY 4X0603 100]  (value not drawn)  (parts A,B,C,D of 4)
R23  100Ω  [RES ARRAY 4X0603 100]  (value not drawn)  (parts A,B,C,D of 4)
R25  100Ω  [RES ARRAY 4X0603 100]  (value not drawn)  (parts A,B,C,D of 4)
R26  100Ω  [RES ARRAY 4X0603 100]  (value not drawn)  (parts A,B,C,D of 4)
R27  100Ω  [RES ARRAY 4X0603 100]  (value not drawn)  (parts A,B,C,D of 4)
R28  100Ω  [RES ARRAY 4X0603 100]  (value not drawn)  (parts A,B,C,D of 4)
R100  100Ω  [RES 0603 100]
R101  100Ω  [RES 0603 100]

### Nets
+3.3: C3.1 C4.1 C5.1 C6.1 C7.1 C13.1 IC1.10(~{SRCLR}) IC1.16(VCC) IC2.10(~{SRCLR}) IC2.16(VCC) IC3.10(~{SRCLR}) IC3.16(VCC) IC4.10(~{SRCLR}) IC4.16(VCC) IC5.10(~{SRCLR}) IC5.16(VCC) IC6.10(~{SRCLR}) IC6.16(VCC) LED2.1(ANODE)
GND: C3.2 C4.2 C5.2 C6.2 C7.2 C13.2 D2.2 D3.2 D4.2 D5.2 D6.2 D7.2 D8.2 D9.2 D10.2 D11.2 D12.2 D13.2 D14.2 D15.2 D16.2 D17.2 D20.2 D21.2 D22.2 D23.2 D24.2 D25.2 D26.2 D27.2 D28.2 D29.2 D30.2 D31.2 D32.2 D33.2 D34.2 D35.2 IC1.8(GND) IC1.13(~{OE}) IC2.8(GND) IC2.13(~{OE}) IC3.8(GND) IC3.13(~{OE}) IC4.8(GND) IC4.13(~{OE}) IC5.8(GND) IC5.13(~{OE}) IC6.8(GND) IC6.13(~{OE}) LED1.2(CATHODE)
DO1: IC4.15(QA)
DO2: IC4.1(QB)
DO3: IC4.2(QC)
DO4: IC4.3(QD)
DO5: IC4.4(QE)
DO6: IC4.5(QF)
DO7: IC4.6(QG)
DO8: IC4.7(QH)
DO9: IC2.15(QA)
DO10: IC2.1(QB)
DO11: IC2.2(QC)
DO12: IC2.3(QD)
DO13: IC2.4(QE)
DO14: IC2.5(QF)
DO15: IC2.6(QG)
DO16: IC2.7(QH)
LED: R100.2 R101.1
SPI2_MOSI: IC6.14(SER)
SPI2_MOSI2: IC5.14(SER) IC6.9(QH')
SPI2_MOSI3: IC1.14(SER) IC5.9(QH')
SPI2_MOSI4: IC1.9(QH') IC3.14(SER)
SPI2_MOSI5: IC2.14(SER) IC3.9(QH')
SPI2_MOSI6: IC2.9(QH') IC4.14(SER)
SPI2_MOSI7: IC4.9(QH')
SPI2_NSS: IC1.12(RCLK) IC2.12(RCLK) IC3.12(RCLK) IC4.12(RCLK) IC5.12(RCLK) IC6.12(RCLK)
SPI2_SCK: IC1.11(SRCLK) IC2.11(SRCLK) IC3.11(SRCLK) IC4.11(SRCLK) IC5.11(SRCLK) IC6.11(SRCLK)
NetD2_1: D2.1 R20.4
NetD3_1: D3.1 R20.3
NetD4_1: D4.1 R20.2
NetD5_1: D5.1 R20.1
NetD6_1: D6.1 R21.4
NetD7_1: D7.1 R21.3
NetD8_1: D8.1 R21.2
NetD9_1: D9.1 R21.1
NetD10_1: D10.1 R22.4
NetD11_1: D11.1 R22.3
NetD12_1: D12.1 R22.2
NetD13_1: D13.1 R22.1
NetD14_1: D14.1 R23.4
NetD15_1: D15.1 R23.3
NetD16_1: D16.1 R23.2
NetD17_1: D17.1 R23.1
NetD20_1: D20.1 R25.1
NetD21_1: D21.1 R25.2
NetD22_1: D22.1 R25.3
NetD23_1: D23.1 R25.4
NetD24_1: D24.1 R26.1
NetD25_1: D25.1 R26.2
NetD26_1: D26.1 R26.3
NetD27_1: D27.1 R26.4
NetD28_1: D28.1 R27.1
NetD29_1: D29.1 R27.2
NetD30_1: D30.1 R27.3
NetD31_1: D31.1 R27.4
NetD32_1: D32.1 R28.1
NetD33_1: D33.1 R28.2
NetD34_1: D34.1 R28.3
NetD35_1: D35.1 R28.4
NetIC1_1: IC1.1(QB) R21.7
NetIC1_2: IC1.2(QC) R21.6
NetIC1_3: IC1.3(QD) R21.5
NetIC1_4: IC1.4(QE) R20.8
NetIC1_5: IC1.5(QF) R20.7
NetIC1_6: IC1.6(QG) R20.6
NetIC1_7: IC1.7(QH) R20.5
NetIC1_15: IC1.15(QA) R21.8
NetIC3_1: IC3.1(QB) R23.7
NetIC3_2: IC3.2(QC) R23.6
NetIC3_3: IC3.3(QD) R23.5
NetIC3_4: IC3.4(QE) R22.8
NetIC3_5: IC3.5(QF) R22.7
NetIC3_6: IC3.6(QG) R22.6
NetIC3_7: IC3.7(QH) R22.5
NetIC3_15: IC3.15(QA) R23.8
NetIC5_1: IC5.1(QB) R25.7
NetIC5_2: IC5.2(QC) R25.6
NetIC5_3: IC5.3(QD) R25.5
NetIC5_4: IC5.4(QE) R26.8
NetIC5_5: IC5.5(QF) R26.7
NetIC5_6: IC5.6(QG) R26.6
NetIC5_7: IC5.7(QH) R26.5
NetIC5_15: IC5.15(QA) R25.8
NetIC6_1: IC6.1(QB) R27.7
NetIC6_2: IC6.2(QC) R27.6
NetIC6_3: IC6.3(QD) R27.5
NetIC6_4: IC6.4(QE) R28.8
NetIC6_5: IC6.5(QF) R28.7
NetIC6_6: IC6.6(QG) R28.6
NetIC6_7: IC6.7(QH) R28.5
NetIC6_15: IC6.15(QA) R27.8
NetLED1_1: LED1.1(ANODE) R101.2
NetLED2_2: LED2.2(CATHODE) R100.1

### Library data of the parts
C3-C7 C13 = CAP 100nF
IC1-IC6 = SN74HC595D: 8-Bit Shift Register With 3-State Output Register; Part Description: 8-Bit Shift Register With 3-State Output Registers; Manufacturer: TEXAS INSTRUMENTS; PressFit: No; Bonding: No; Part Number: SN74HC595D; Component Kind: Standard; Component Type: Standard; Device: SN74HC595D; PackageDescription: SOIC 16, Pitch 1.27mm - Body 4x10mm, IPC Medium Density; Manufacturer Part Number: SN74HC595D; Pin Count: 16; Case: SOIC16; Mounted: Yes; Socket: No; SMD: Yes; Sense: No; ComponentHeight: 1.75mm; Author: CERN DEM JLC; HelpURL: \\cern.ch\dfs\Applications\Altium\Datasheets\SN74HC595D.pdf; CreateDate: 6/5/2012; LatestRevisionDate: 6/5/2012
LED1 = LED_THD_5MM_GRN: LED, THD, 5MM, GREEN; DESC: DESCRIPTION; MANF_P#: MANF_PART#; PARAM2: 2.2V; MANF: MANF; ASSEMBLY: ASSEMBLY; PRICE: PRICE; VALUE: LED5MM_GRN
LED2 = LED_THD_5MM_RED: LED, THD, 5MM, RED; DESC: DESCRIPTION; MANF_P#: MANF_PART#; PARAM2: 2.2V; MANF: MANF; ASSEMBLY: ASSEMBLY; PRICE: PRICE; VALUE: LED5MM_RED
R20-R23 R25-R28 = RES ARRAY 100
R100 R101 = RES 100

## Nets that join several sheets
+3.3: Microcontroller (21 pins), Digital Input (16 pins), Connector (10 pins), Indicator (19 pins)
+ISO: Digital Output (32 pins), Connector (P2.2 P3#2.7 P3#2.8)
-ISO: Digital Input (16 pins), Digital Output (16 pins), Connector (J8.3 P2.1 P3#2.9 P3#2.10)
GND: Microcontroller (27 pins), Digital Input (16 pins), Digital Output (16 pins), Connector (10 pins), Indicator (51 pins)
AI or NSS1: Microcontroller (U4.8), Connector (j17.1)
AI or NSS2: Microcontroller (U4.9), Connector (j18.1)
AI or NSS3: Microcontroller (U4.10), Connector (j19.1)
AI or NSS4: Microcontroller (U4.11), Connector (j20.1)
AI or NSS5: Microcontroller (U4.14), Connector (j21.1)
AI or NSS6: Microcontroller (U4.15), Connector (j22.1)
AO or AI or NSS1: Microcontroller (U4.16), Connector (j23.1)
AO or AI or NSS2: Microcontroller (U4.17), Connector (j24.1)
DI1: Microcontroller (U4.62), Digital Input (OP1.10 R48.4)
DI2: Microcontroller (U4.61), Digital Input (OP1.12 R48.3)
DI3: Microcontroller (U4.59), Digital Input (OP1.14 R48.2)
DI4: Microcontroller (U4.58), Digital Input (OP1.16 R48.1)
DI5: Microcontroller (U4.52), Digital Input (OP3.10 R50.4)
DI6: Microcontroller (U4.51), Digital Input (OP3.12 R50.3)
DI7: Microcontroller (U4.50), Digital Input (OP3.14 R50.2)
DI8: Microcontroller (U4.45), Digital Input (OP3.16 R50.1)
DI9: Microcontroller (U4.44), Digital Input (OP5.10 R52.4)
DI10: Microcontroller (U4.42), Digital Input (OP5.12 R52.3)
DI11: Microcontroller (U4.43), Digital Input (OP5.14 R52.2)
DI12: Microcontroller (U4.41), Digital Input (OP5.16 R52.1)
DI13: Microcontroller (U4.40), Digital Input (OP7.10 R54.4)
DI14: Microcontroller (U4.39), Digital Input (OP7.12 R54.3)
DI15: Microcontroller (U4.38), Digital Input (OP7.14 R54.2)
DI16: Microcontroller (U4.37), Digital Input (OP7.16 R54.1)
DO1: Digital Output (R49.1), Indicator (IC4.15)
DO2: Digital Output (R49.2), Indicator (IC4.1)
DO3: Digital Output (R49.3), Indicator (IC4.2)
DO4: Digital Output (R49.4), Indicator (IC4.3)
DO5: Digital Output (R51.1), Indicator (IC4.4)
DO6: Digital Output (R51.2), Indicator (IC4.5)
DO7: Digital Output (R51.3), Indicator (IC4.6)
DO8: Digital Output (R51.4), Indicator (IC4.7)
DO9: Digital Output (R53.1), Indicator (IC2.15)
DO10: Digital Output (R53.2), Indicator (IC2.1)
DO11: Digital Output (R53.3), Indicator (IC2.2)
DO12: Digital Output (R53.4), Indicator (IC2.3)
DO13: Digital Output (R55.1), Indicator (IC2.4)
DO14: Digital Output (R55.2), Indicator (IC2.5)
DO15: Digital Output (R55.3), Indicator (IC2.6)
DO16: Digital Output (R55.4), Indicator (IC2.7)
IO1: Digital Input (BR1.3), Digital Output (D36.1), Connector (F1.1)
IO2: Digital Input (BR2.3), Digital Output (D37.1), Connector (F2.1)
IO3: Digital Input (BR3.3), Digital Output (D38.1), Connector (F3.1)
IO4: Digital Input (BR4.3), Digital Output (D39.1), Connector (F4.1)
IO5: Digital Input (BR5.3), Digital Output (D40.1), Connector (F5.1)
IO6: Digital Input (BR6.3), Digital Output (D41.1), Connector (F6.1)
IO7: Digital Input (BR7.3), Digital Output (D42.1), Connector (F7.1)
IO8: Digital Input (BR8.3), Digital Output (D43.1), Connector (F8.1)
IO9: Digital Input (BR9.3), Digital Output (D44.1), Connector (F9.1)
IO10: Digital Input (BR10.3), Digital Output (D45.1), Connector (F10.1)
IO11: Digital Input (BR11.3), Digital Output (D46.1), Connector (F11.1)
IO12: Digital Input (BR12.3), Digital Output (D47.1), Connector (F12.1)
IO13: Digital Input (BR13.3), Digital Output (D48.1), Connector (F13.1)
IO14: Digital Input (BR14.3), Digital Output (D49.1), Connector (F14.1)
IO15: Digital Input (BR15.3), Digital Output (D50.1), Connector (F15.1)
IO16: Digital Input (BR16.3), Digital Output (D51.1), Connector (F16.1)
LED: Microcontroller (U4.54), Indicator (R100.2 R101.1)
RS485_N: Microcontroller (R29.2 R30.2 U2.2), Connector (P1.4)
RS485_P: Microcontroller (R29.1 R31.2 U2.1), Connector (P1.5)
SPI1_MISO: Microcontroller (U4.56), Connector (8 pins)
SPI1_MOSI: Microcontroller (U4.57), Connector (8 pins)
SPI1_SCK: Microcontroller (U4.55), Connector (8 pins)
SPI2_MOSI: Microcontroller (U4.36), Indicator (IC6.14)
SPI2_MOSI7: Connector (P2.6), Indicator (IC4.9)
SPI2_NSS: Microcontroller (U4.33), Connector (P2.3), Indicator (6 pins)
SPI2_SCK: Microcontroller (U4.34), Connector (P2.4), Indicator (6 pins)